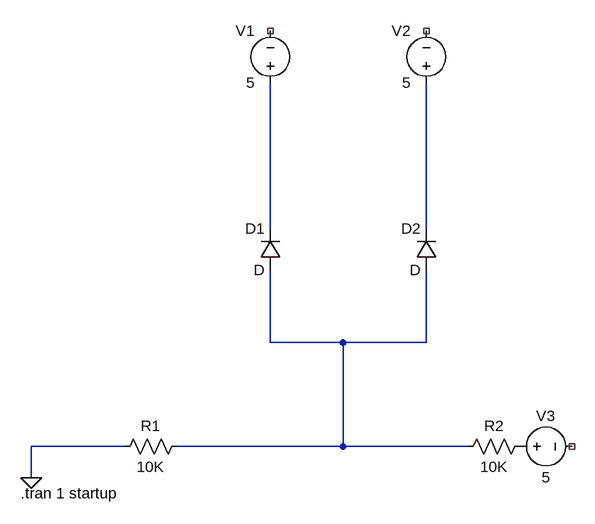
[diagram p0: schematic AND-circuit.asc]
AND-circuit.asc, the LTspice schematic file:
Version 4.1
SHEET 1 880 680
WIRE -160 0 -160 -224
WIRE 80 0 80 -224
WIRE -160 176 -160 64
WIRE -48 176 -160 176
WIRE 80 176 80 64
WIRE 80 176 -48 176
WIRE -384 336 -528 336
WIRE -48 336 -48 176
WIRE -48 336 -304 336
WIRE 144 336 -48 336
WIRE -528 384 -528 336
FLAG -528 384 0
SYMBOL diode -144 64 R180
WINDOW 0 24 64 Left 2
WINDOW 3 24 0 Left 2
SYMATTR InstName D1
SYMBOL diode 96 64 R180
WINDOW 0 24 64 Left 2
WINDOW 3 24 0 Left 2
SYMATTR InstName D2
SYMBOL res -288 320 R90
WINDOW 0 0 56 VBottom 2
WINDOW 3 32 56 VTop 2
SYMATTR InstName R1
SYMATTR Value 10K
SYMATTR SpiceLine tol=1 pwr=0.1
SYMBOL voltage -160 -208 R180
WINDOW 0 24 96 Left 2
WINDOW 3 24 16 Left 2
WINDOW 123 0 0 Left 0
WINDOW 39 0 0 Left 0
SYMATTR InstName V1
SYMATTR Value 5
SYMBOL voltage 80 -208 R180
WINDOW 0 24 96 Left 2
WINDOW 3 24 16 Left 2
WINDOW 123 0 0 Left 0
WINDOW 39 0 0 Left 0
SYMATTR InstName V2
SYMATTR Value 5
SYMBOL res 240 320 R90
WINDOW 0 0 56 VBottom 2
WINDOW 3 32 56 VTop 2
SYMATTR InstName R2
SYMATTR Value 10K
SYMATTR SpiceLine tol=1 pwr=0.1
SYMBOL voltage 208 336 R270
WINDOW 0 32 56 VTop 2
WINDOW 3 -32 56 VBottom 2
WINDOW 123 0 0 Left 0
WINDOW 39 0 0 Left 0
SYMATTR InstName V3
SYMATTR Value 5
TEXT -544 408 Left 2 !.tran 1 startup

The netlist it stands for:
* AND-circuit.asc
D1 N003 N001 D
D2 N003 N002 D
R1 N003 0 10K tol=1 pwr=0.1
V1 N001 NC_01 5
V2 N002 NC_02 5
R2 P001 N003 10K tol=1 pwr=0.1
V3 P001 NC_03 5
.model D D
.lib standard.dio
.tran 1 startup
.backanno
.end